# EAGLE design has_breakoff (EAGLE 9.6.2)
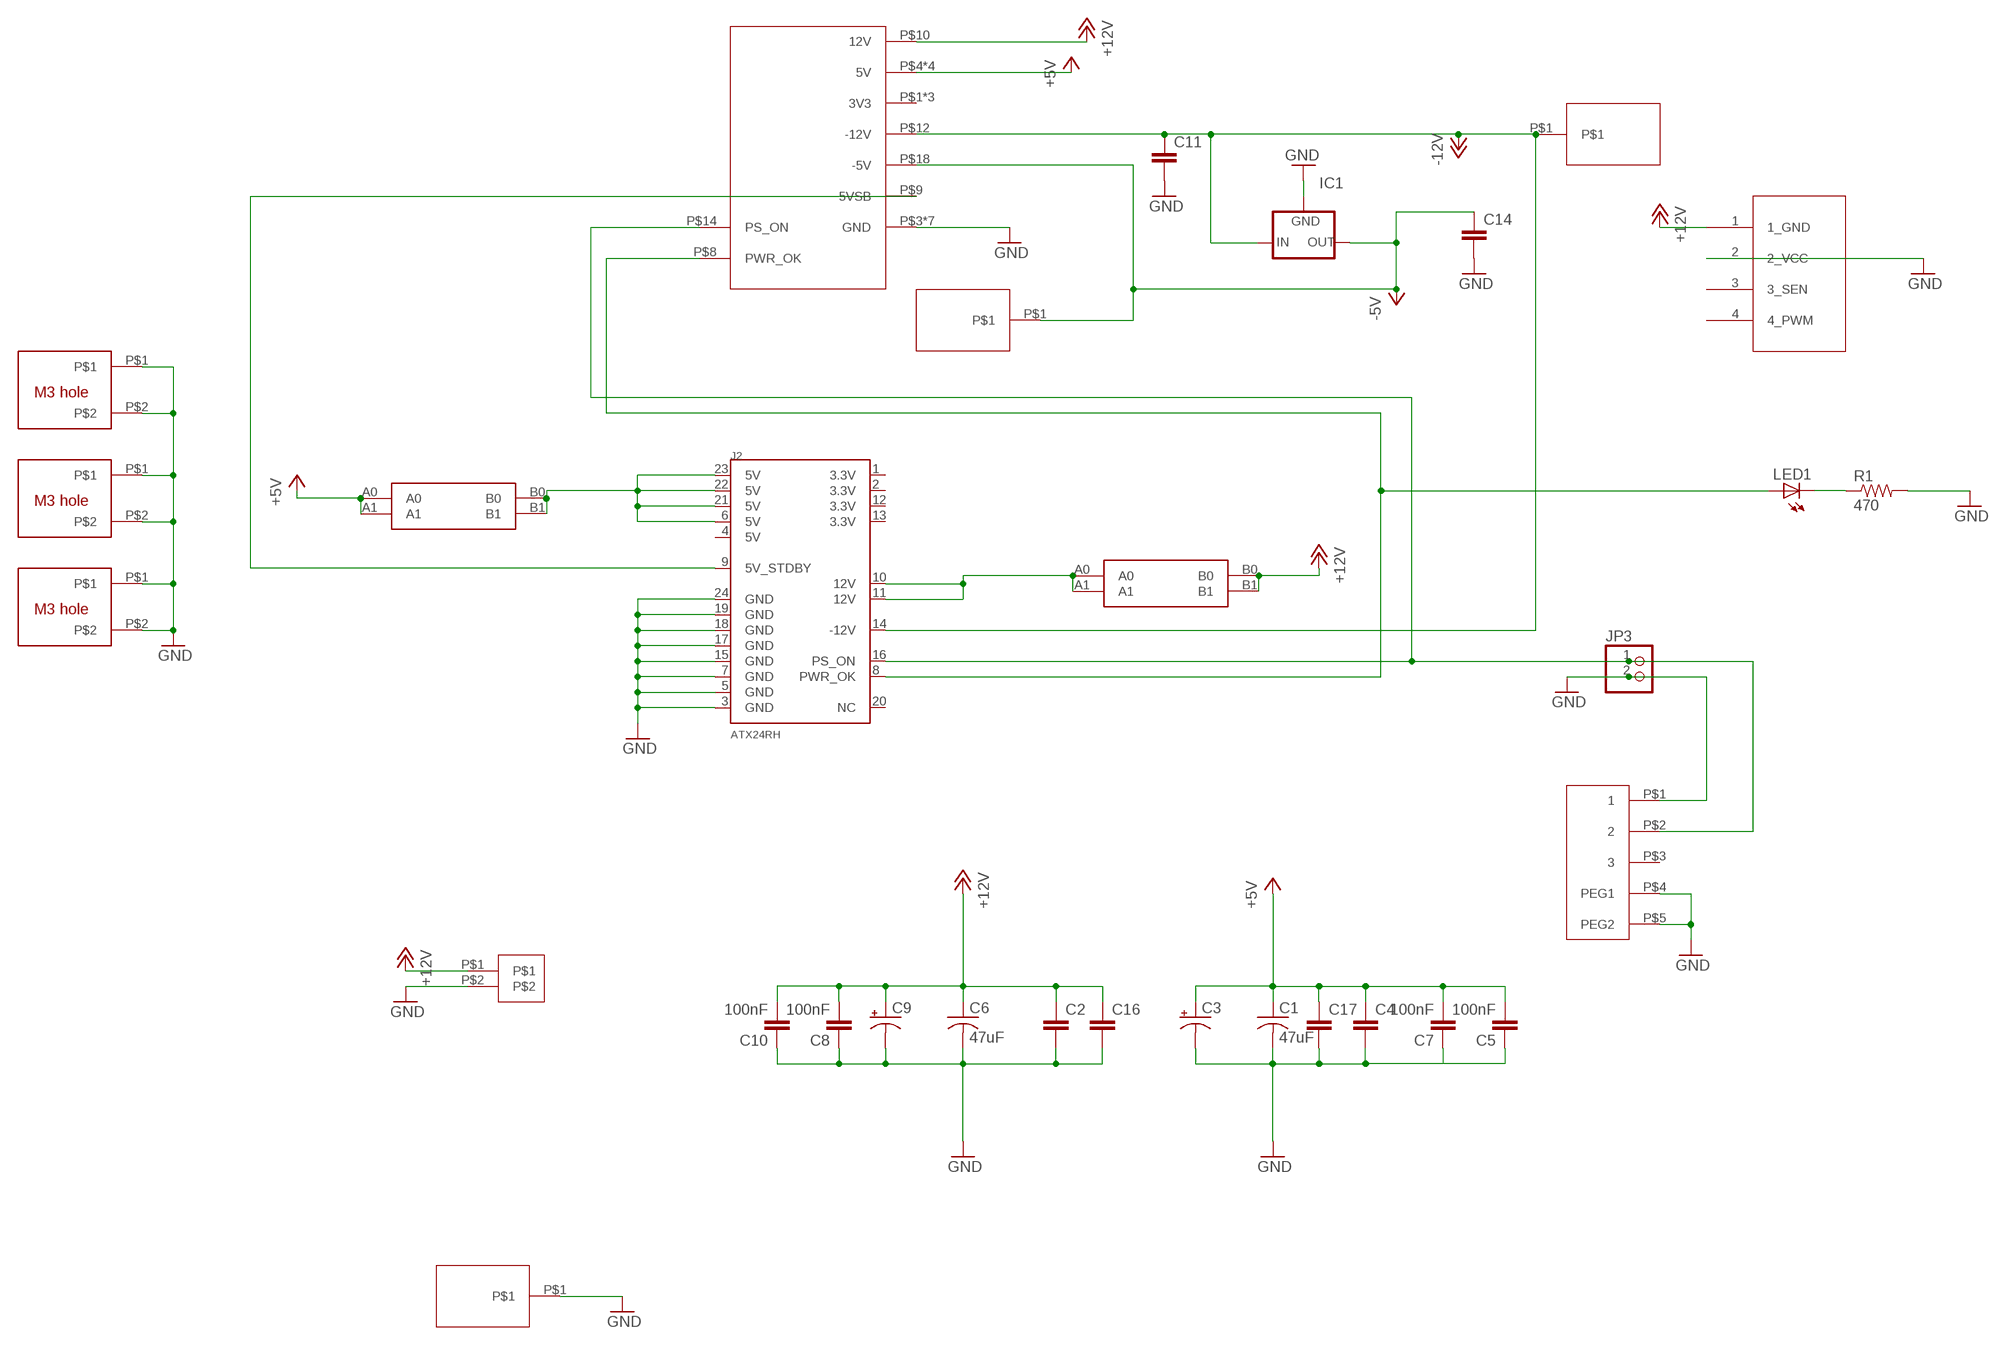
[diagram p0: schematic, sheet 1]

## Parts
C1  47uF  C-USC1210  [C1210]
C2  C5/2.5  [C5B2.5]
C3  CPOL-USE3.5-8  [E3,5-8]
C4  C5/2.5  [C5B2.5]
C5  100nF  CAP0805  [0805@1]
C6  47uF  C-USC1210  [C1210]
C7  100nF  CAP0805  [0805@1]
C8  100nF  CAP0805  [0805@1]
C9  CPOL-USE3.5-8  [E3,5-8]
C10  100nF  CAP0805  [0805@1]
C11  C5/2.5  [C5B2.5]
C14  C5/2.5  [C5B2.5]
C16  C5/2.5  [C5B2.5]
C17  C5/2.5  [C5B2.5]
IC1  79XXS  [79XXS]
J2  ATX24RH  [ATX24_RIGHT_ANGLE]
JP1  4PIN_FAN  [1X04]
JP3  PINHD-1X2  [1X02]
LED1  LED5MM  [LED5MM]
R1  470  R-US_0207/10  [0207/10]
U$1  20PEDGE  [20P_EDGE]
U$2  CAR_FUSE_HOLDER3IN1  [FUSE_HOLDER_3IN1]
U$3  VH396_2P  [396_2P]
U$4  ROCKSW  [ROCKSW]
U$5  M3_MOUNTING_HOLE  [M3_MOUNTING_HOLE_PACK]
U$6  M3_MOUNTING_HOLE  [M3_MOUNTING_HOLE_PACK]
U$7  ISA  [ISAPAD]
U$8  CAR_FUSE_HOLDER3IN1  [FUSE_HOLDER_3IN1]
U$9  ISA  [ISAPAD]
U$10  ISA  [ISAPAD]
U$11  M3_MOUNTING_HOLE  [M3_MOUNTING_HOLE_PACK]

## Nets
+5V: C1.1 C3.+ C4.1 C5.2 C7.2 C17.1 U$1.P$4(5V) U$1.P$6(5V) U$1.P$19(5V) U$1.P$20(5V) U$8.A0 U$8.A1
+12V: C2.1 C6.1 C8.2 C9.+ C10.2 C16.1 JP1.1(1_GND) U$1.P$10(12V) U$2.B0 U$2.B1 U$3.P$1
-5V: C14.1 IC1.OUT U$1.P$18(-5V) U$7.P$1
-12V: C11.1 IC1.IN J2.14(-12V) U$1.P$12(-12V) U$10.P$1
GND: C1.2 C2.2 C3.- C4.2 C5.1 C6.2 C7.1 C8.1 C9.- C10.1 C11.2 C14.2 C16.2 C17.2 IC1.GND J2.3(GND) J2.5(GND) J2.7(GND) J2.15(GND) J2.17(GND) J2.18(GND) J2.19(GND) J2.24(GND) JP1.2(2_VCC) JP3.2 R1.2 U$1.P$3(GND) U$1.P$5(GND) U$1.P$7(GND) U$1.P$13(GND) U$1.P$15(GND) U$1.P$16(GND) U$1.P$17(GND) U$3.P$2 U$4.P$1 U$4.P$4(PEG1) U$4.P$5(PEG2) U$5.P$1 U$5.P$2 U$6.P$1 U$6.P$2 U$9.P$1 U$11.P$1 U$11.P$2
N$3: J2.16(PS_ON) JP3.1 U$1.P$14(PS_ON) U$4.P$2
N$4: J2.8(PWR_OK) LED1.A U$1.P$8(PWR_OK)
N$5: J2.9(5V_STDBY) U$1.P$9(5VSB)
N$6: J2.6(5V) J2.21(5V) J2.22(5V) J2.23(5V) U$8.B0 U$8.B1
N$8: J2.10(12V) J2.11(12V) U$2.A0 U$2.A1
N$12: LED1.K(C) R1.1
Unconnected: J2.1(3.3V) J2.2(3.3V) J2.4(5V) J2.12(3.3V) J2.13(3.3V) J2.20(NC) JP1.3(3_SEN) JP1.4(4_PWM) U$1.P$1(3V3) U$1.P$2(3V3) U$1.P$11(3V3) U$4.P$3

## Library data of the parts
C1 C6 = clock:C-US: CAPACITOR, American symbol
C2 C4 C11 C14 C16 C17 = capacitor-wima:C: CAPACITOR naming: grid - package width
C3 C9 = adafruit_changed:CPOL-US: POLARIZED CAPACITOR, American symbol
C5 C7 C8 C10 = clock:CAP: Capacitor Standard 0603 ceramic capacitor, and 0.1" leaded capacitor.
IC1 = v-reg:79XXS: VOLTAGE REGULATOR
J2 = macse:ATX24: ATX24 Pin Power Supply Connector This is a good connector for connecting a computer power supply to a PCB. It's massive, but provides many amps of power at 5V and 12V. SKU: PRT-09498
JP1 = appleii:4PIN_FAN: PIN HEADER
JP3 = pinhead:PINHD-1X2: PIN HEADER
LED1 = adafruit:LED: LED OSRAM: - CHIPLED LG R971, LG N971, LY N971, LG Q971, LY Q971, LO R971, LY R971 LH N974, LH R974 LS Q976, LO Q976, LY Q976 LO Q996 - Hyper CHIPLED LW Q18S LB Q993, LB Q99A, LB R99A - SideLED LS A670, LO A670, LY A670, LG A670, LP A670 LB A673, LV A673, LT A673, LW A673 LH A674 LY A675 LS A676, LA A676, LO A676, LY A676, LW A676 LS A679, LY A679, LG A679 - Hyper Micro SIDELED® LS Y876, LA Y876, LO Y876, LY Y876 LT Y87S - SmartLED LW L88C, LW L88S LB L89C, LB L89S, LG L890 LS L89K, LO L89K, LY L89K LS L896, LA L896, LO L896, LY L896 - TOPLED LS T670, LO T670, LY T670, LG T670, LP T670 LSG T670, LSP T670, LSY T670, LOP T670, LYG T670 LG T671, LOG T671, LSG T671 LB T673, LV T673, LT T673, LW T673 LH T674 LS T676, LA T676, LO T676, LY T676, LB T676, LH T676, LSB T676, LW T676 LB T67C, LV T67C, LT T67C, LS T67K, LO T67K, LY T67K, LW E67C LS E67B, LA E67B, LO E67B, LY E67B, LB E67C, LV E67C, LT E67C LW T67C LS T679, LY T679, LG T679 LS T770, LO T770, LY T770, LG T770, LP T770 LB T773, LV T773, LT T773, LW T773 LH T774 LS E675, LA E675, LY E675, LS T675 LS T776, LA T776, LO T776, LY T776, LB T776 LHGB T686 LT T68C, LB T68C - Hyper Mini TOPLED® LB M676 - Mini TOPLED Santana® LG M470 LS M47K, LO M47K, LY M47K Source: http://www.osram.convergy.de/
R1 = adafruit:R-US_: RESISTOR, American symbol
U$1 = apricot:20PEDGE
U$2 U$8 = atx_power_control:CAR_FUSE_HOLDER
U$3 = 396_conn:VH396_2P
U$4 = apricot:ROCKSW
U$5 U$6 U$11 = apricot:M3_MOUNTING_HOLE
U$7 U$9 U$10 = blade:ISA

## Board
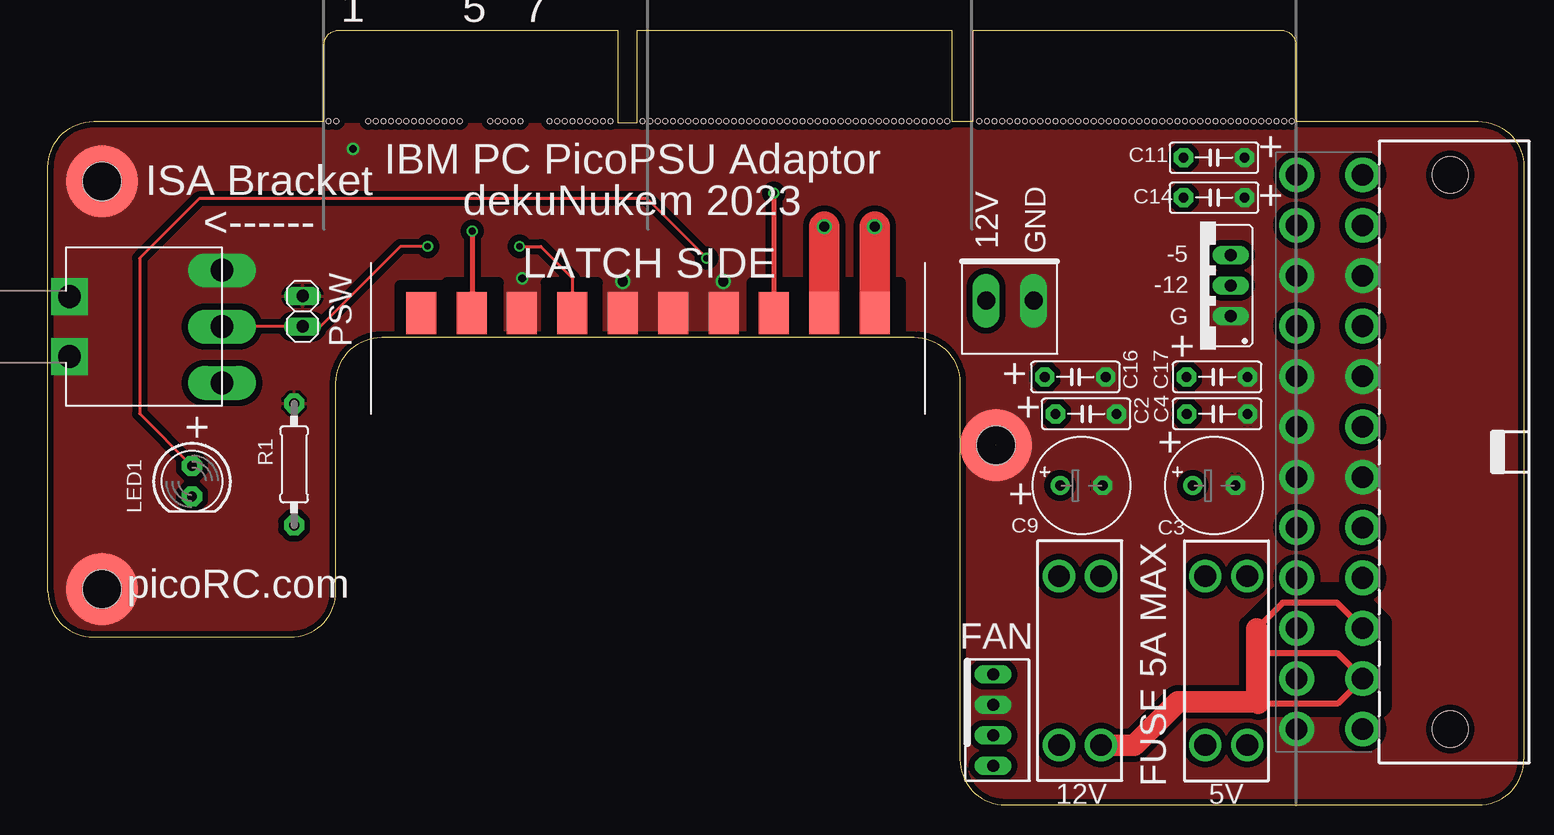
[diagram p1: board, top side]
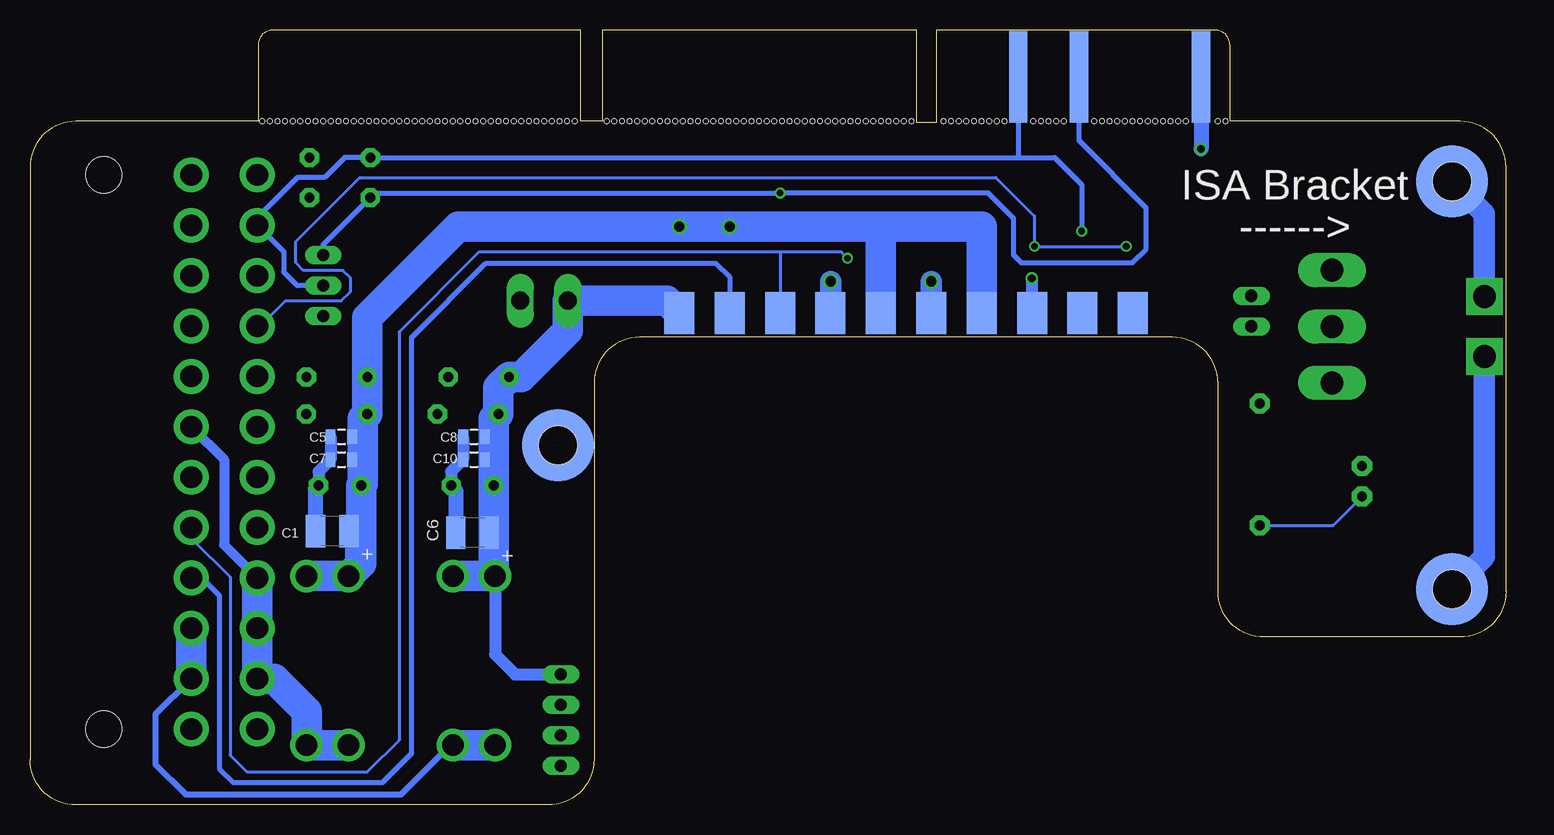
[diagram p2: board, bottom side, seen from below]

Size 123 x 64.62 mm. Coordinates in mm from the lower left corner, seen from the top.
Outline: 76,35.19 76,3.81 arc90 79.81,0 119.19,0 arc90 123,3.81 123,53.19 arc90 119.19,57 104,57 104,63.35 arc90 102.73,64.62 77.11,64.62 77.11,57 75.31,57 75.31,64.62 49.09,64.62 49.09,56.87 47.48,56.87 47.48,64.62 24.27,64.62 arc90 23,63.35 23,57 3.81,57 arc90 0,53.19 0,17.81 arc90 3.81,14 20.19,14 arc90 24,17.81 24,35.19 arc-90 27.81,39 72.19,39 arc-90 76,35.19
Copper layers (1*16): Top 0.035mm / dielectric 1.5mm / Bottom 0.035mm
Design rules "deku_2layer_6mil *": minimum track width 6mil, minimum drill 15mil, track to track 20mil, track to pad 6mil, pad to pad 6mil, via to via 6mil, smd to smd 6mil, copper to edge 10mil, drill to drill 6mil, minimum pad ring 7mil, minimum via ring 7mil, stop-mask expansion 4mil, vias tented up to drill 25mil, thermal gap 10mil
Holes 0.38 mm at 23.38,57.02 24.02,57.02 26.69,57.02 27.32,57.02 27.96,57.02 28.59,57.02 29.23,57.02 29.86,57.02 30.5,57.02 31.13,57.02 31.77,57.02 32.4,57.02 33.04,57.02 33.67,57.02 34.31,57.02 36.85,57.02 37.48,57.02 38.12,57.02 38.75,57.02 39.39,57.02 42.43,57.02 43.07,57.02 43.7,57.02 44.34,57.02 44.97,57.02 45.61,57.02 46.24,57.02 46.88,57.02 49.55,57.02 50.18,57.02 50.82,57.02 51.45,57.02 52.09,57.02 52.72,57.02 53.36,57.02 53.99,57.02 54.63,57.02 55.26,57.02 55.9,57.02 56.53,57.02 57.17,57.02 57.8,57.02 58.44,57.02 59.07,57.02 59.71,57.02 60.34,57.02 60.98,57.02 61.61,57.02 62.25,57.02 62.88,57.02 63.52,57.02 64.15,57.02 64.79,57.02 65.42,57.02 66.06,57.02 66.69,57.02 67.33,57.02 67.96,57.02 68.6,57.02 69.23,57.02 69.87,57.02 70.5,57.02 71.14,57.02 71.77,57.02 72.41,57.02 73.04,57.02 73.68,57.02 74.31,57.02 74.95,57.02 77.61,57.02 78.25,57.02 78.88,57.02 79.52,57.02 80.15,57.02 80.79,57.02 81.42,57.02 82.06,57.02 82.69,57.02 83.33,57.02 83.96,57.02 84.6,57.02 85.23,57.02 85.87,57.02 86.5,57.02 87.14,57.02 87.77,57.02 88.41,57.02 89.04,57.02 89.68,57.02 90.31,57.02 90.95,57.02 91.58,57.02 92.22,57.02 92.85,57.02 93.49,57.02 94.12,57.02 94.76,57.02 95.39,57.02 96.03,57.02 96.66,57.02 97.3,57.02 97.93,57.02 98.57,57.02 99.2,57.02 99.84,57.02 100.47,57.02 101.11,57.02 101.74,57.02 102.38,57.02 103.01,57.02 103.65,57.02 41.8,57.02
tRestrict: area 33.3,38.6 to 37.5,43.5; area 41.5,38.6 to 45.7,43.5; area 58.7,38.6 to 62.9,43.5; area 62.6,38.6 to 66.8,43.5; area 66.8,38.6 to 71,43.5; area 99.8,7.9 to 111.4,18; area 29.4,38.3 to 33.5,43.3

### Footprints (pad centres in the part's own frame; a part is rotated, then mirrored left to right if it is on the bottom)
C1210 = smd 1.6 x 2.7: 1 -1.4,0; 2 1.4,0
C5B2.5 = drill 0.813 pad 1.6 octagon: 1 -2.54,0; 2 2.54,0
E3,5-8 = drill 0.813 pad 1.6: + -1.778,0 | drill 0.813 pad 1.6 octagon: - 1.778,0
0805@1 = smd 0.8 x 1.2: 1 -0.9,0; 2 0.9,0
79XXS = drill 1.016 long: GND -2.54,-2.54; IN 0,-2.54; OUT 2.54,-2.54
ATX24_RIGHT_ANGLE = drill 1.8 pad 2.9: 1 23.1,4.76; 2 18.9,4.76; 3 14.7,4.76; 4 10.5,4.76; 5 6.3,4.76; 6 2.1,4.76; 7 -2.1,4.76; 8 -6.3,4.76; 9 -10.5,4.76; 10 -14.7,4.76; 11 -18.9,4.76; 12 -23.1,4.76; 13 23.1,10.26; 14 18.9,10.26; 15 14.7,10.26; 16 10.5,10.26; 17 6.3,10.26; 18 2.1,10.26; 19 -2.1,10.26; 20 -6.3,10.26; 21 -10.5,10.26; 22 -14.7,10.26; 23 -18.9,10.26; 24 -23.1,10.26 | hole 3: -23.1,-2.54; 23.1,-2.54
1X04 = drill 1.016 long: 1 -3.81,0; 2 -1.27,0; 3 1.27,0; 4 3.81,0
1X02 = drill 1.016 long: 1 -1.27,0; 2 1.27,0
LED5MM = drill 0.813 pad 1.676 octagon: A -1.27,0; K 1.27,0
0207/10 = drill 0.813 pad 1.676 octagon: 1 -5.08,0; 2 5.08,0
20P_EDGE = smd 2.5 x 3.5 bottom: P$1 -18.9,0; P$2 -14.7,0; P$3 -10.5,0; P$4 -6.3,0; P$5 -2.1,0; P$6 2.1,0; P$7 6.3,0; P$8 10.5,0; P$9 14.7,0; P$10 18.9,0 | smd 2.5 x 3.5: P$11 -18.9,0; P$12 -14.7,0; P$13 -10.5,0; P$14 -6.3,0; P$15 -2.1,0; P$16 2.1,0; P$17 6.3,0; P$18 10.5,0; P$19 14.7,0; P$20 18.9,0
FUSE_HOLDER_3IN1 = drill 1.8: A0 -7.05,1.75; A1 -7.05,-1.75; B0 7.05,1.75; B1 7.05,-1.75
396_2P = drill 1.5 long: P$1 -1.98,0; P$2 1.98,0
ROCKSW = drill 1.9 long: P$1 0,4.7; P$2 0,0; P$3 0,-4.7 | drill 1.9 pad 3.048 square: P$4 -12.7,2.5; P$5 -12.7,-2.5
M3_MOUNTING_HOLE_PACK = smd 6 x 6 bottom: P$1 0,0 | smd 6 x 6: P$2 0,0 | hole 3.2: 0,0
ISAPAD = smd 1.524 x 7.62: P$1 0,0

### Placement (x,y rotation side)
C1  97.81,22.83 180 bottom
C2  86.51,32.61 0 top
C3  97.18,26.64 0 top
C4  97.43,32.61 0 top
C5  97.05,30.7 0 bottom
C6  86.13,22.7 180 bottom
C7  97.05,28.8 0 bottom
C8  86,30.7 0 bottom
C9  86.13,26.64 0 top
C10  86,28.8 0 bottom
C11  97.17,53.98 0 top
C14  97.18,50.64 0 top
C16  85.61,35.69 0 top
C17  97.42,35.69 0 top
IC1  96.03,43.31 90 top
J2  114.32,29.43 90 top
JP1  78.76,7.08 270 top
JP3  21.22,41.18 90 top
LED1  12,27 270 top
R1  20.52,28.4 90 top
U$1  50,41 0 top
U$2  86,12.03 90 top
U$3  80.15,42.04 0 top
U$4  14.5,39.89 0 top
U$5  4.5,18 90 top
U$6  4.5,52 90 top
U$7  35.58,60.71 0 bottom
U$8  98.19,12.03 270 top
U$9  25.41,60.71 0 bottom
U$10  40.65,60.71 0 bottom
U$11  79,30 0 top

### Tracks (layer width: path | path; a pad name or v marks a point on that pad's centre or on a via)
+5V  (via drill 0.85)
  Top 2.54: U$1.P$19 v64.7,48.23 | v68.89,48.23 68.89,41 U$1.P$20
  Bottom 0.61: C4.1 96.15,31.35 C5.2 C7.2 | U$8.A1 96.44,22.8 C1.1
  Bottom 2.54: 52.1,48.23 v64.7,48.23 v68.89,48.23 87.3,48.23 94.89,40.64 C17.1 C4.1 95.27,32.23 95.27,26.77 C3.+ 95.4,20.13 U$8.A1 U$8.A0 | 52.1,48.23 U$1.P$6 | 52.1,48.23 43.7,48.23 U$1.P$4
+12V
  Bottom 0.61: C2.1 85.11,31.46 85.11,30.69 C8.2 C10.2 85.1,27.39 C9.+ 84.73,26.26 C6.1
  Bottom 1.016: U$2.B0 84.25,12.57 82.57,10.89 JP1.1
  Bottom 2.54: U$2.B1 U$2.B0 84.35,19.18 C9.+ 84.35,32.23 C2.1 83.97,34.79 C16.1 82.06,35.69 78.17,39.57 U$3.P$1 69.94,42.04 U$1.P$10
-5V  (via drill 0.55)
  Top 0.406: v60.49,51.03 U$1.P$18
  Bottom 0.406: U$7.P$1 35.58,55.37 29.99,49.78 29.99,46.35 31.13,45.21 40.4,45.21 41.04,45.85 41.04,48.9 43.16,51.02 v60.5,51.02 | IC1.OUT 98.57,46.71 C14.1 94.25,51.02 v60.5,51.02 | v60.5,51.02 v60.49,51.03
-12V  (via drill 0.55)
  Top 0.406: v35.36,47.85 35.36,41.06 U$1.P$12
  Bottom 0.406: 40.66,53.98 C11.1 96.79,53.98 98.44,52.32 100.73,52.32 104.06,48.99 J2.14 101.87,46.14 101.87,44.45 100.73,43.31 IC1.IN | 40.66,53.98 37.61,53.98 35.36,51.73 v35.36,47.85 | U$10.P$1 40.65,53.98 40.66,53.98
GND  (via drill 0.65, 0.85)  (1 unrouted)
  Bottom 1.016: v39.52,43.91 39.52,41 U$1.P$13 | C8.1 C10.1 87.91,27.79 C9.- | C5.1 C7.1 98.95,27.79 C3.-
  Bottom 1.27: C9.- 87.53,26.26 C6.2 | C3.- 99.21,26.38 C1.2 | U$9.P$1 25.41,54.71 v25.42,54.7
  Bottom 1.778: U$1.P$17 56.28,41.02 v56.28,43.66 | v47.9,43.66 U$1.P$5 | U$4.P$4 1.8,49.3 U$6.P$2 | U$4.P$5 1.8,20.7 U$5.P$2
  pour Top (isolate 0.508): 124.13,56.75 -0.52,56.75 -0.52,-0.46 124.13,-0.5
  pour Top (no thermals): 87.14,36.83 90.19,36.83 90.19,31.37 87.14,31.37
  pour Top (no thermals): 98.82,36.83 101.23,36.83 101.23,31.62 98.82,31.62
  pour Top (no thermals): 87.01,27.94 89.04,27.94 89.04,25.15 87.01,25.15
  pour Top (no thermals): 97.81,27.56 100.22,27.56 100.22,25.4 97.81,25.4
  pour Top (no thermals): 98.44,55.24 101.11,55.24 101.11,52.7 98.44,52.7
  pour Top (no thermals): 98.44,51.94 101.11,51.94 101.11,49.15 98.44,49.15
  pour Top (no thermals): 96.54,41.78 100.6,41.78 100.6,38.99 96.54,38.99
N$3  (via drill 0.55)
  Top 0.254: v39.3,46.58 41.07,46.58 43.7,43.95 U$1.P$14 | v31.64,46.58 29.36,46.58 22.69,39.91 JP3.1 14.52,39.91 U$4.P$2
  Bottom 0.254: v31.64,46.58 v39.3,46.58 39.3,49.12 42.5,52.32 95.52,52.32 100.85,46.99 100.85,45.21 100.22,44.58 96.92,44.58 96.28,43.94 96.28,42.8 97.04,42.04 101.7,42.04 103.81,39.93 J2.16
N$4  (via drill 0.55)
  Top 0.254: v54.88,45.59 49.93,50.55 12.59,50.55 7.64,45.59 7.64,32.63 LED1.A
  Bottom 0.254: J2.8 109.56,22.24 106.32,19 106.32,4.16 104.92,2.76 94.89,2.76 92.25,5.4 92.25,39.44 85.59,46.1 60.5,46.1 | 60.5,46.1 U$1.P$8 | v54.88,45.59 55.39,46.1 60.5,46.1
N$5
  Bottom 0.406: J2.9 108.67,18.93 107.21,17.47 107.21,3.02 106.07,1.87 93.62,1.87 91.2,4.29 91.2,38.99 85.01,45.18 65.84,45.18 64.7,44.04 U$1.P$9
N$6
  Bottom 0.813: J2.6 106.83,28.8 106.83,21.7 J2.21
  Bottom 2.54: J2.21 J2.22 J2.23 102.66,10.53 99.94,7.81 U$8.B0 U$8.B1
N$8
  Top 0.508: J2.10 107.43,16.86 102.89,16.86 100.73,14.7 | 100.73,12.67 107.42,12.67 J2.11 107.51,8.48 100.86,8.48
  Top 1.778: 100.73,14.7 100.73,12.67 100.73,8.6 | 100.73,8.6 100.86,8.48 | 100.73,8.6 94.13,8.6 90.51,4.98 U$2.A1
  Bottom 0.508: U$2.A1 87.97,4.98 92.07,0.88 110.03,0.88 112.54,3.4 112.54,7.55 J2.11
  Bottom 2.54: J2.10 J2.11 | U$2.A0 U$2.A1
N$12
  Bottom 0.254: R1.1 14.41,23.32 LED1.K

### Text on the board
tNames: put a sticker on 7905 laying down footprint | 1 | 5 | 7 | + | IBM PC PicoPSU Adaptor / dekuNukem 2023 | + | ISA Bracket / <------ | 12V | GND | -5 | -12 | PSW | G | 1 and 0 on ISA bracket? / just cut out the outline | + | + | + | + | + | + | picoRC.com | FAN | FUSE 5A MAX | 12V | 5V
bNames: ISA Bracket / ------>